# Altium schematic sheet MCU.SchDoc
size A4; SheetNumber: 4; SheetTotal: 4
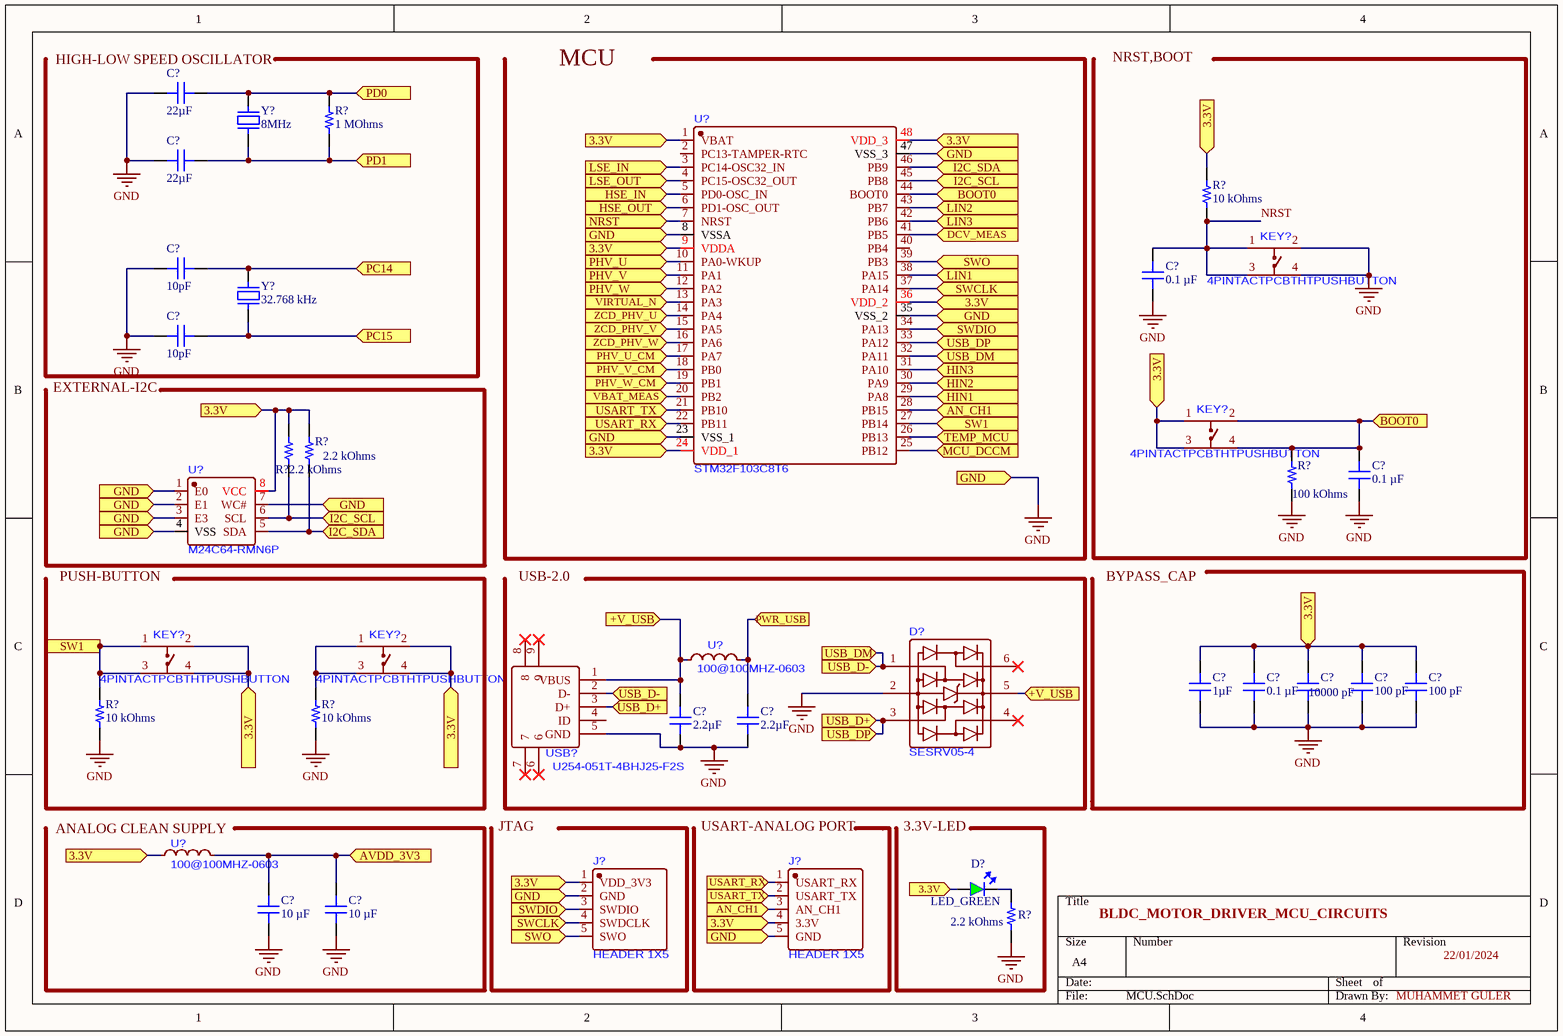
[diagram p0: MCU.SchDoc]

## Parts
(Parts that share a designator on the sheet are numbered #1, #2 ... from top to bottom, then left to right.)
C?#1  22µF  [CAP 1210_3225 - 2.8MM]
C?#2  22µF  [CAP 1210_3225 - 2.8MM]
C?#3  10pF  [CAP 1210_3225 - 1.4MM]
C?#4  0.1 µF  [CAP 1210_3225 - 1MM]
C?#5  10pF  [CAP 1210_3225 - 1.4MM]
C?#6  0.1 µF  [CAP 1210_3225 - 1MM]
C?#7  1µF  [CAP 1210_3225 - 2.8MM]
C?#8  0.1 µF  [CAP 1210_3225 - 1MM]
C?#9  10000 pF  [CAP 1210_3225 - 1MM]
C?#10  100 pF  [CAP 1210_3225 - 1MM]
C?#11  100 pF  [CAP 1210_3225 - 1MM]
C?#12  2.2µF  [CAP 1210_3225 - 2.8MM]
C?#13  2.2µF  [CAP 1210_3225 - 2.8MM]
C?#14  10 µF  [CAP 1210_3225 - 1MM]
C?#15  10 µF  [CAP 1210_3225 - 1MM]
D?#1  SESRV05-4  [SOT-23-6_L2.9-W1.6-P0.95-LS2.8-BR]
D?#2  LED_GREEN  [LED_GREEN]
J?#1  HEADER 1X5  [1X5-PIN-HEADER-2.54MM_ES]
J?#2  HEADER 1X5  [1X5-PIN-HEADER-2.54MM_ES]
KEY?#1  4PINTACTPCBTHTPUSHBUTTON  [SW-SMD_4P-L6.0-W6.0-P4.50-LS10.0_TL3301EF160QG]
KEY?#2  4PINTACTPCBTHTPUSHBUTTON  [SW-SMD_4P-L6.0-W6.0-P4.50-LS10.0_TL3301EF160QG]
KEY?#3  4PINTACTPCBTHTPUSHBUTTON  [SW-SMD_4P-L6.0-W6.0-P4.50-LS10.0_TL3301EF160QG]
KEY?#4  4PINTACTPCBTHTPUSHBUTTON  [SW-SMD_4P-L6.0-W6.0-P4.50-LS10.0_TL3301EF160QG]
R?#1  1 MOhms  [RES 1210_3225]
R?#2  10 kOhms  [RES 1210_3225]
R?#3  2.2 kOhms  [RES 1210_3225]
R?#4  2.2 kOhms  [RES 1210_3225]
R?#5  100 kOhms  [RES 1210_3225]
R?#6  10 kOhms  [RES 1210_3225]
R?#7  10 kOhms  [RES 1210_3225]
R?#8  2.2 kOhms  [RES 1210_3225]
U?#1  STM32F103C8T6  [UFQFPN-48_STM32]
U?#2  M24C64-RMN6P  [SOIC-8_L4.9-W3.8-P1.27-LS6.0-BL]
U?#3  100@100MHZ-0603  [L0603]
U?#4  100@100MHZ-0603  [L0603]
USB?  U254-051T-4BHJ25-F2S  [MICRO-USB-SMD_U254-051T-4BHJ25-F2S]
Y?#1  8MHz  [ABRACON ABLS]
Y?#2  32.768 kHz  [MICRO CRYSTAL CM8V H0.6mm]

## Ports
3.3V (in, see DRIVER[3A], DRIVER[4B], MCU[1B], MCU[1C], MCU[1D], MCU[2A], MCU[2B], MCU[2C], MCU[2D], MCU[3A], MCU[3B], MCU[3D], MCU[4A], MCU[4C], POWER[2A], POWER[3A], POWER[3B], POWER[4A], PROTECTION[2D], PROTECTION[4A], PROTECTION[4B]), 3.3V (in, see DRIVER[3A], DRIVER[4B], MCU[1B], MCU[1C], MCU[1D], MCU[2A], MCU[2B], MCU[2C], MCU[2D], MCU[3A], MCU[3B], MCU[3D], MCU[4A], POWER[2A], POWER[3A], POWER[3B], POWER[4A], PROTECTION[2D], PROTECTION[4A], PROTECTION[4B]), 3.3V (in, see DRIVER[3A], DRIVER[4B], MCU[1B], MCU[1C], MCU[1D], MCU[2A], MCU[2B], MCU[2C], MCU[2D], MCU[3A], MCU[3B], MCU[3D], MCU[4C], POWER[2A], POWER[3A], POWER[3B], POWER[4A], PROTECTION[2D], PROTECTION[4A], PROTECTION[4B]), 3.3V (in, see DRIVER[3A], DRIVER[4B], MCU[1B], MCU[1C], MCU[1D], MCU[2A], MCU[2B], MCU[2C], MCU[2D], MCU[3A], MCU[3B], MCU[4A], MCU[4C], POWER[2A], POWER[3A], POWER[3B], POWER[4A], PROTECTION[2D], PROTECTION[4A], PROTECTION[4B]), 3.3V (in, see DRIVER[3A], DRIVER[4B], MCU[1B], MCU[1C], MCU[1D], MCU[2A], MCU[2B], MCU[2C], MCU[2D], MCU[3B], MCU[3D], MCU[4A], MCU[4C], POWER[2A], POWER[3A], POWER[3B], POWER[4A], PROTECTION[2D], PROTECTION[4A], PROTECTION[4B]), 3.3V (in, see DRIVER[3A], DRIVER[4B], MCU[1B], MCU[1C], MCU[1D], MCU[2A], MCU[2B], MCU[2D], MCU[3A], MCU[3B], MCU[3D], MCU[4A], MCU[4C], POWER[2A], POWER[3A], POWER[3B], POWER[4A], PROTECTION[2D], PROTECTION[4A], PROTECTION[4B]), 3.3V (in, see DRIVER[3A], DRIVER[4B], MCU[1B], MCU[1C], MCU[1D], MCU[2A], MCU[2C], MCU[2D], MCU[3A], MCU[3B], MCU[3D], MCU[4A], MCU[4C], POWER[2A], POWER[3A], POWER[3B], POWER[4A], PROTECTION[2D], PROTECTION[4A], PROTECTION[4B]), 3.3V (in, see DRIVER[3A], DRIVER[4B], MCU[1B], MCU[1C], MCU[2A], MCU[2B], MCU[2C], MCU[2D], MCU[3A], MCU[3B], MCU[3D], MCU[4A], MCU[4C], POWER[2A], POWER[3A], POWER[3B], POWER[4A], PROTECTION[2D], PROTECTION[4A], PROTECTION[4B]), 3.3V (in, see DRIVER[3A], DRIVER[4B], MCU[1B], MCU[1D], MCU[2A], MCU[2B], MCU[2C], MCU[2D], MCU[3A], MCU[3B], MCU[3D], MCU[4A], MCU[4C], POWER[2A], POWER[3A], POWER[3B], POWER[4A], PROTECTION[2D], PROTECTION[4A], PROTECTION[4B]), 3.3V (in, see DRIVER[3A], DRIVER[4B], MCU[1C], MCU[1D], MCU[2A], MCU[2B], MCU[2C], MCU[2D], MCU[3A], MCU[3B], MCU[3D], MCU[4A], MCU[4C], POWER[2A], POWER[3A], POWER[3B], POWER[4A], PROTECTION[2D], PROTECTION[4A], PROTECTION[4B]), +V_USB (in, see MCU[2C]), +V_USB (in, see MCU[3C]), AN_CH1 (in, see MCU[2D]), AN_CH1 (in, see MCU[3B]), AVDD_3V3 (in), BOOT0 (in, see MCU[3A]), BOOT0 (in, see MCU[4B]), DCV_MEAS (in, see POWER[4C]), GND (in, see MCU[1B], MCU[1C], MCU[2A], MCU[2B], MCU[2D], MCU[3A], MCU[3B]), GND (in, see MCU[1B], MCU[1C], MCU[2A], MCU[2B], MCU[2D], MCU[3B]), GND (in, see MCU[1B], MCU[1C], MCU[2A], MCU[2D], MCU[3A], MCU[3B]), GND (in, see MCU[1B], MCU[1C], MCU[2B], MCU[2D], MCU[3A], MCU[3B]), HIN1 (in, see DRIVER[1A]), HIN2 (in, see DRIVER[1C]), HIN3 (in, see DRIVER[4C]), HSE_IN (in), HSE_OUT (in), I2C_SCL (in, see MCU[1C]), I2C_SCL (in, see MCU[3A]), I2C_SDA (in, see MCU[1C]), I2C_SDA (in, see MCU[3A]), LIN1 (in, see DRIVER[1A]), LIN2 (in, see DRIVER[1C]), LIN3 (in, see DRIVER[4C]), LSE_IN (in), LSE_OUT (in), MCU_DCCM (in, see POWER[4D]), NRST (in), PC14 (in), PC15 (in), PD0 (in), PD1 (in), PHV_U (in, see DRIVER[2A], DRIVER[3B], PROTECTION[3A]), PHV_U_CM (in, see POWER[3A], PROTECTION[4A]), PHV_V (in, see DRIVER[3B], DRIVER[4A], PROTECTION[3A]), PHV_V_CM (in, see POWER[3B], PROTECTION[4A]), PHV_W (in, see DRIVER[3B], DRIVER[4B], PROTECTION[3A]), PHV_W_CM (in, see POWER[4A], PROTECTION[4A]), PWR_USB (in), SW1 (in, see MCU[1C]), SW1 (in, see MCU[3B]), SWCLK (in, see MCU[2D]), SWCLK (in, see MCU[3B]), SWDIO (in, see MCU[2D]), SWDIO (in, see MCU[3B]), SWO (in, see MCU[2D]), SWO (in, see MCU[3B]), TEMP_MCU (in, see PROTECTION[3B], PROTECTION[4C]), USART_RX (in, see MCU[2B]), USART_RX (in, see MCU[2D]), USART_TX (in, see MCU[2B]), USART_TX (in, see MCU[2D]), USB_D+ (in, see MCU[2C]), USB_D+ (in, see MCU[3C]), USB_D- (in, see MCU[2C]), USB_D- (in, see MCU[3C]), USB_DM (in, see MCU[3B]), USB_DM (in, see MCU[3C]), USB_DP (in, see MCU[3B]), USB_DP (in, see MCU[3C]), VBAT_MEAS (in, see POWER[4C]), VIRTUAL_N (in, see DRIVER[2A], DRIVER[2B], DRIVER[4A], DRIVER[4B], PROTECTION[3A]), ZCD_PHV_U (in, see DRIVER[3A], DRIVER[4A], DRIVER[4B]), ZCD_PHV_V (in), ZCD_PHV_W (in)

## Nets
GND: C?#1.1 C?#2.1 C?#3.1 C?#4.2 C?#5.1 C?#6.2 C?#7.2 C?#8.2 C?#9.2 C?#10.2 C?#11.2 C?#12.2 C?#13.2 C?#14.2 C?#15.2 D?#1.2 J?#1.2(GND) J?#2.5(GND) KEY?#1.2 KEY?#1.4 R?#5.2 R?#6.2 R?#7.2 R?#8.2 U?#1.8(VSSA) U?#1.23(VSS_1) U?#1.35(VSS_2) U?#1.47(VSS_3) U?#2.1(E0) U?#2.2(E1) U?#2.3(E3) U?#2.4(VSS) U?#2.7(WC#) USB?.5(GND) ; port GND
3.3V: C?#7.1 C?#8.1 C?#9.1 C?#10.1 C?#11.1 D?#2.1(IN) J?#1.1(VDD_3V3) J?#2.4(3.3V) KEY?#2.1 KEY?#2.3 KEY?#3.2 KEY?#3.4 KEY?#4.2 KEY?#4.4 R?#2.1 R?#3.1 R?#4.1 U?#1.1(VBAT) U?#1.9(VDDA) U?#1.24(VDD_1) U?#1.36(VDD_2) U?#1.48(VDD_3) U?#2.8(VCC) U?#4.1 ; port 3.3V
+V_USB: C?#12.1 D?#1.5 U?#3.1 USB?.1(VBUS) ; port +V_USB
AN_CH1: J?#2.3(AN_CH1) U?#1.28(PB15) ; port AN_CH1
AVDD_3V3: C?#14.1 C?#15.1 U?#4.2 ; port AVDD_3V3
BOOT0: C?#6.1 KEY?#2.2 KEY?#2.4 R?#5.1 U?#1.44(BOOT0) ; port BOOT0
DCV_MEAS: U?#1.41(PB5) ; port DCV_MEAS
HIN1: U?#1.29(PA8) ; port HIN1
HIN2: U?#1.30(PA9) ; port HIN2
HIN3: U?#1.31(PA10) ; port HIN3
HSE_IN: U?#1.5(PD0-OSC_IN) ; port HSE_IN
HSE_OUT: U?#1.6(PD1-OSC_OUT) ; port HSE_OUT
I2C_SCL: R?#3.2 U?#1.45(PB8) U?#2.6(SCL) ; port I2C_SCL
I2C_SDA: R?#4.2 U?#1.46(PB9) U?#2.5(SDA) ; port I2C_SDA
LIN1: U?#1.38(PA15) ; port LIN1
LIN2: U?#1.43(PB7) ; port LIN2
LIN3: U?#1.42(PB6) ; port LIN3
LSE_IN: U?#1.3(PC14-OSC32_IN) ; port LSE_IN
LSE_OUT: U?#1.4(PC15-OSC32_OUT) ; port LSE_OUT
MCU_DCCM: U?#1.25(PB12) ; port MCU_DCCM
NRST: U?#1.7(NRST) ; port NRST
NRST: C?#4.1 KEY?#1.1 KEY?#1.3 R?#2.2  [a separate net that carries the same name]
PC14: C?#3.2 Y?#2.1 ; port PC14
PC15: C?#5.2 Y?#2.2 ; port PC15
PD0: C?#1.2 R?#1.1 Y?#1.1 ; port PD0
PD1: C?#2.2 R?#1.2 Y?#1.2 ; port PD1
PHV_U: U?#1.10(PA0-WKUP) ; port PHV_U
PHV_U_CM: U?#1.17(PA7) ; port PHV_U_CM
PHV_V: U?#1.11(PA1) ; port PHV_V
PHV_V_CM: U?#1.18(PB0) ; port PHV_V_CM
PHV_W: U?#1.12(PA2) ; port PHV_W
PHV_W_CM: U?#1.19(PB1) ; port PHV_W_CM
PWR_USB: C?#13.1 U?#3.2 ; port PWR_USB
SW1: KEY?#3.1 KEY?#3.3 R?#6.1 U?#1.27(PB14) ; port SW1
SWCLK: J?#1.4(SWDCLK) U?#1.37(PA14) ; port SWCLK
SWDIO: J?#1.3(SWDIO) U?#1.34(PA13) ; port SWDIO
SWO: J?#1.5(SWO) U?#1.39(PB3) ; port SWO
TEMP_MCU: U?#1.26(PB13) ; port TEMP_MCU
USART_RX: J?#2.1(USART_RX) U?#1.22(PB11) ; port USART_RX
USART_TX: J?#2.2(USART_TX) U?#1.21(PB10) ; port USART_TX
USB_D+: D?#1.3 U?#1.33(PA12) USB?.3(D+) ; port USB_DP, port USB_D+
USB_D-: D?#1.1 U?#1.32(PA11) USB?.2(D-) ; port USB_DM, port USB_D-
VBAT_MEAS: U?#1.20(PB2) ; port VBAT_MEAS
VIRTUAL_N: U?#1.13(PA3) ; port VIRTUAL_N
ZCD_PHV_U: U?#1.14(PA4) ; port ZCD_PHV_U
ZCD_PHV_V: U?#1.15(PA5) ; port ZCD_PHV_V
ZCD_PHV_W: U?#1.16(PA6) ; port ZCD_PHV_W
NetD?#2_2: D?#2.2(OUT) R?#8.1
NetKEY?#4_1: KEY?#4.1 KEY?#4.3 R?#7.1

Not connected (* = marked no-connect by the designer): D?#1 4* 6*; U?#1 2(PC13-TAMPER-RTC) 40(PB4); USB? 4(ID) 6* 7* 8* 9*

## Notes on the sheet
- HIGH-LOW SPEED OSCILLATOR
- MCU
- NRST,BOOT
- (near C?#5) EXTERNAL-I2C
- PUSH-BUTTON
- USB-2.0
- BYPASS_CAP
- (near U?#4) ANALOG CLEAN SUPPLY
- JTAG
- (near J?#2) USART-ANALOG PORT
- 3.3V-LED
- BLDC_MOTOR_DRIVER_MCU_CIRCUITS
- 22/01/2024
- MUHAMMET GÜLER

## Library data of the parts
C?#1 C?#2 = 1210ZC226MAT2A: CAP CER 22UF 10V X7R 1210; manufacturer: AVX Corporation; Tolerance: ±20%; Part Number: 1210ZC226MAT2A; Value: 22µF; Applications: General Purpose; Capacitance: 22µF; componentlink1description: Datasheet; componentlink1url: http://datasheets.avx.com/X7RDielectric.pdf; componentlink2description: DigiKey Link; componentlink2url: http://digikey.com/product-detail/en/avx-corporation/1210ZC226MAT2A/478-7982-1-ND/3881605; Device Package: 1210 (3225 Metric); lastupdated: 2.09.2020 01:10:53; Lifecycle Status: Active; Minimum Order: 1; Mounting Type: Surface Mount, MLCC; Operating Temperature: -55°C ~ 125°C; Package / Case: 1210 (3225 Metric); packaging: TapeAndReel; partid: 23621; Part Status: Active; price: 0.60; series: -; Size / Dimension: 0.126" L x 0.098" W (3.20mm x 2.50mm); Supplier 1: DigiKey; Supplier Part Number 1: 478-7982-1-ND; Temperature Coefficient: X7R; Thickness (Max): 0.110" (2.79mm); Voltage - Rated: 10V
C?#3 C?#5 = 12102U100JAT2A: CAP CER 10PF 200V NP0 1210; manufacturer: AVX Corporation; Temperature Coefficient: C0G, NP0; Tolerance: ±5%; Part Number: 12102U100JAT2A; Value: 10pF; Applications: RF, Microwave, High Frequency; Capacitance: 10pF; componentlink1description: Datasheet; componentlink1url: http://datasheets.avx.com/U-Series.pdf; componentlink2description: DigiKey Link; componentlink2url: http://digikey.com/product-detail/en/avx-corporation/12102U100JAT2A/478-10909-1-ND/7536424; Device Package: 1210 (3225 Metric); Features: Ultra Low ESR; lastupdated: 2.09.2020 01:10:31; Lifecycle Status: Active; Minimum Order: 1; Mounting Type: Surface Mount, MLCC; Operating Temperature: -55°C ~ 125°C; Package / Case: 1210 (3225 Metric); packaging: TapeAndReel; partid: 25047; Part Status: Active; price: 0.17; series: U; Size / Dimension: 0.126" L x 0.098" W (3.20mm x 2.49mm); Supplier 1: DigiKey; Supplier Part Number 1: 478-10909-1-ND; Thickness (Max): 0.055" (1.40mm); Voltage - Rated: 200V
C?#4 C?#6 C?#8 = 1210Y0500104KST: 1210 50VDC 100NF 10% X7R(2R1) AE; manufacturer: Knowles Syfer; Voltage - Rated: 50V; Part Number: 1210Y0500104KST; Value: 0.1 µF; Applications: Automotive, Boardflex Sensitive; Capacitance: 0.1 µF; componentlink2description: DigiKey Link; componentlink2url: https://www.digikey.com/en/products/detail/knowles-syfer/1210Y0500104KST/18879780; Device Package: 1210 (3225 Metric); Features: Soft Termination; lastupdated: 17.01.2024 20:42:33; Lifecycle Status: Active; Minimum Order: 1; Mounting Type: Surface Mount, MLCC; Operating Temperature: -55°C ~ 125°C; Package / Case: 1210 (3225 Metric); packaging: TapeAndReel; partid: 53037; Part Status: Active; price: 0.16; Ratings: AEC-Q200; series: FlexiCap™; Size / Dimension: 0.126" L x 0.098" W (3.20mm x 2.50mm); Supplier 1: DigiKey; Supplier Part Number 1: 1608-1210Y0500104KSTCT-ND; Temperature Coefficient: X7R (2R1); Thickness (Max): 0.079" (2.00mm); Tolerance: ±10%
C?#7 = 12101C105MAT2A: CAP CER 1UF 100V X7R 1210; manufacturer: AVX Corporation; Tolerance: ±20%; Part Number: 12101C105MAT2A; Value: 1µF; Applications: General Purpose; Capacitance: 1µF; componentlink1description: Datasheet; componentlink1url: http://datasheets.avx.com/X7RDielectric.pdf; componentlink2description: DigiKey Link; componentlink2url: http://digikey.com/product-detail/en/avx-corporation/12101C105MAT2A/478-2571-1-ND/717516; Device Package: 1210 (3225 Metric); lastupdated: 2.09.2020 01:10:52; Lifecycle Status: Active; Minimum Order: 1; Mounting Type: Surface Mount, MLCC; Operating Temperature: -55°C ~ 125°C; Package / Case: 1210 (3225 Metric); packaging: TapeAndReel; partid: 23736; Part Status: Active; price: 0.21; series: -; Size / Dimension: 0.126" L x 0.098" W (3.20mm x 2.50mm); Supplier 1: DigiKey; Supplier Part Number 1: 478-2571-1-ND; Temperature Coefficient: X7R; Thickness (Max): 0.110" (2.79mm); Voltage - Rated: 100V
C?#9 = C1210X103JDGACAUTO: CAP CER 1210 10NF 1000V C0G 5%; manufacturer: KEMET; Temperature Coefficient: C0G, NP0; Voltage - Rated: 1000V (1kV); Part Number: C1210X103JDGACAUTO; Value: 10000 pF; Applications: Automotive, Boardflex Sensitive; Capacitance: 10000 pF; componentlink1description: Datasheet; componentlink1url: https://api.kemet.com/component-edge/download/datasheet/C1210X103JDGACAUTO.pdf; componentlink2description: DigiKey Link; componentlink2url: https://www.digikey.com/en/products/detail/kemet/C1210X103JDGACAUTO/10131738; Device Package: 1210 (3225 Metric); Features: Low ESL, Soft Termination, High Voltage; lastupdated: 17.01.2024 20:42:53; Lifecycle Status: Active; Minimum Order: 1; Mounting Type: Surface Mount, MLCC; Operating Temperature: -55°C ~ 125°C; Package / Case: 1210 (3225 Metric); packaging: TapeAndReel; partid: 24146; Part Status: Active; price: 0.96; Ratings: AEC-Q200; series: SMD Auto C0G HV Flex; Size / Dimension: 0.130" L x 0.102" W (3.30mm x 2.60mm); Supplier 1: DigiKey; Supplier Part Number 1: 399-20934-1-ND; Thickness (Max): 0.110" (2.80mm); Tolerance: ±5%
C?#10 C?#11 = VJ1210A101JXGAT5Z: CAP CER 100PF 1KV C0G/NP0 1210; manufacturer: Vishay Vitramon; Temperature Coefficient: C0G, NP0; Tolerance: ±5%; Voltage - Rated: 1000V (1kV); Part Number: VJ1210A101JXGAT5Z; Value: 100 pF; Applications: General Purpose; Capacitance: 100 pF; componentlink1description: Datasheet; componentlink1url: http://www.vishay.com/docs/45197/vjhvarcguard.pdf; componentlink2description: DigiKey Link; componentlink2url: https://www.digikey.com/en/products/detail/vishay-vitramon/VJ1210A101JXGAT5Z/1559962; Device Package: 1210 (3225 Metric); Features: High Voltage; lastupdated: 17.01.2024 20:43:04; Lifecycle Status: Active; Minimum Order: 1; Mounting Type: Surface Mount, MLCC; Operating Temperature: -55°C ~ 125°C; Package / Case: 1210 (3225 Metric); packaging: TapeAndReel; partid: 24731; Part Status: Active; price: 0.44; series: VJ HVArc Guard™; Size / Dimension: 0.126" L x 0.098" W (3.20mm x 2.50mm); Supplier 1: DigiKey; Supplier Part Number 1: 720-1035-1-ND; Thickness (Max): 0.067" (1.70mm)
C?#12 C?#13 = 12105C225KAZ2A: CAP CER 2.2UF 50V X7R 1210; manufacturer: AVX Corporation; Tolerance: ±10%; Part Number: 12105C225KAZ2A; Value: 2.2µF; Applications: Boardflex Sensitive; Capacitance: 2.2µF; componentlink1description: Datasheet; componentlink1url: http://datasheets.avx.com/FlexitermMLCC.pdf; componentlink2description: DigiKey Link; componentlink2url: http://digikey.com/product-detail/en/avx-corporation/12105C225KAZ2A/478-3591-1-ND/1024944; Device Package: 1210 (3225 Metric); Features: Soft Termination; lastupdated: 2.09.2020 01:10:53; Lifecycle Status: Active; Minimum Order: 1; Mounting Type: Surface Mount, MLCC; Operating Temperature: -55°C ~ 125°C; Package / Case: 1210 (3225 Metric); packaging: TapeAndReel; partid: 23620; Part Status: Active; price: 0.53; series: FLEXITERM®; Size / Dimension: 0.126" L x 0.098" W (3.20mm x 2.50mm); Supplier 1: DigiKey; Supplier Part Number 1: 478-3591-1-ND; Temperature Coefficient: X7R; Thickness (Max): 0.110" (2.79mm); Voltage - Rated: 50V
C?#14 C?#15 = GCG32ER71E106KA12L: CAP CER 10UF 25V X7R 1210; manufacturer: Murata Electronics; Tolerance: ±10%; Part Number: GCG32ER71E106KA12L; Value: 10 µF; Applications: Automotive; Capacitance: 10 µF; componentlink1description: Datasheet; componentlink1url: https://search.murata.co.jp/Ceramy/image/img/A01X/G101/ENG/GCG32ER71E106KA12-01.pdf; componentlink2description: DigiKey Link; componentlink2url: https://www.digikey.com/en/products/detail/murata-electronics/GCG32ER71E106KA12L/9867908; Device Package: 1210 (3225 Metric); Features: Epoxy Mountable; lastupdated: 18.01.2024 20:41:44; Lifecycle Status: Active; Minimum Order: 1; Mounting Type: Surface Mount, MLCC, Epoxy; Operating Temperature: -55°C ~ 125°C; Package / Case: 1210 (3225 Metric); packaging: TapeAndReel; partid: 23619; Part Status: Active; price: 0.30; Ratings: AEC-Q200; series: GCG; Size / Dimension: 0.126" L x 0.098" W (3.20mm x 2.50mm); Supplier 1: DigiKey; Supplier Part Number 1: 490-18199-1-ND; Temperature Coefficient: X7R; Thickness (Max): 0.110" (2.80mm); Voltage - Rated: 25V
J?#1 J?#2 = HEADER 1X5 COPY
R?#1 = TNPV12101M00DEEA: RES SMD 1M OHM 0.5% 1/3W 1210; Manufacturer: Vishay Dale; Power (Watts): 0.333W, 1/3W; Temperature Coefficient: ±25ppm/°C; Part Number: TNPV12101M00DEEA; ComponentLink1Description: Datasheet; ComponentLink1URL: http://www.vishay.com/docs/28881/tnpve3.pdf; ComponentLink2Description: DigiKey Link; ComponentLink2URL: https://www.digikey.com/en/products/detail/vishay-dale/TNPV12101M00DEEA/6570120; Composition: Thin Film; Device Package: 1210 (3225 Metric); Features: Anti-Sulfur, Automotive AEC-Q200, High Voltage, Moisture Resistant; Height - Seated (Max): 0.030" (0.75mm); LastUpdated: 17.01.2024 21:50:34; Lifecycle Status: Active; Minimum Order: 1; Number of Terminations: 2; Operating Temperature: -55°C ~ 125°C; Package / Case: 1210 (3225 Metric); Packaging: TapeAndReel; Part Status: Active; Price: 0.46; Ratings: AEC-Q200; Resistance: 1 MOhms; Series: TNPV; Size / Dimension: 0.126" L x 0.096" W (3.20mm x 2.45mm); Supplier 1: DigiKey; Supplier Part Number 1: 541-3267-1-ND; Supplier Device Package: 1210; Tolerance: ±0.5%; Value: 1 MOhms
R?#2 R?#6 R?#7 = RMCF1210FT10K0: RES 10K OHM 1% 1/2W 1210; Manufacturer: Stackpole Electronics Inc; Power (Watts): 0.5W, 1/2W; Temperature Coefficient: ±100ppm/°C; Part Number: RMCF1210FT10K0; ComponentLink1Description: Datasheet; ComponentLink1URL: https://www.seielect.com/catalog/sei-rmcf_rmcp.pdf; ComponentLink2Description: DigiKey Link; ComponentLink2URL: https://www.digikey.com/en/products/detail/stackpole-electronics-inc/RMCF1210FT10K0/1758528; Composition: Thick Film; Device Package: 1210 (3225 Metric); Features: Automotive AEC-Q200; Height - Seated (Max): 0.028" (0.70mm); Lifecycle Status: Active; Minimum Order: 1; Number of Terminations: 2; Operating Temperature: -55°C ~ 155°C; Package / Case: 1210 (3225 Metric); Packaging: TapeAndReel; Part Status: Active; Price: 0.01; Ratings: AEC-Q200; Resistance: 10 kOhms; Series: RMCF; Size / Dimension: 0.126" L x 0.098" W (3.20mm x 2.50mm); Supplier 1: DigiKey; Supplier Part Number 1: RMCF1210FT10K0CT-ND; Supplier Device Package: 1210; Tolerance: ±1%; Value: 10 kOhms
  R?#2: LastUpdated: 17.01.2024 21:50:41
  R?#6 R?#7: LastUpdated: 16.01.2024 21:51:52
R?#3 R?#4 = RK73B2ETTD222J: RES 2.2K OHM 5% 1/2W 1210; Manufacturer: KOA Speer Electronics, Inc.; Power (Watts): 0.5W, 1/2W; Temperature Coefficient: ±200ppm/°C; Part Number: RK73B2ETTD222J; ComponentLink1Description: Datasheet; ComponentLink1URL: http://www.koaspeer.com/catimages/Products/RK73B/RK73B.pdf; ComponentLink2Description: DigiKey Link; ComponentLink2URL: https://www.digikey.com/en/products/detail/koa-speer-electronics-inc/RK73B2ETTD222J/10314985; Composition: Thick Film; Device Package: 1210 (3225 Metric); Features: Automotive AEC-Q200; Height - Seated (Max): 0.028" (0.70mm); LastUpdated: 18.01.2024 21:50:16; Lifecycle Status: Active; Minimum Order: 1; Number of Terminations: 2; Operating Temperature: -55°C ~ 155°C; Package / Case: 1210 (3225 Metric); Packaging: TapeAndReel; Part Status: Active; Price: 0.01; Ratings: AEC-Q200; Resistance: 2.2 kOhms; Series: RK73B; Size / Dimension: 0.126" L x 0.102" W (3.20mm x 2.60mm); Supplier 1: DigiKey; Supplier Part Number 1: 2019-RK73B2ETTD222JCT-ND; Supplier Device Package: 1210; Tolerance: ±5%; Value: 2.2 kOhms
R?#5 = RMCF1210FT100K: RES 100K OHM 1% 1/2W 1210; Manufacturer: Stackpole Electronics Inc; Power (Watts): 0.5W, 1/2W; Temperature Coefficient: ±100ppm/°C; Part Number: RMCF1210FT100K; ComponentLink1Description: Datasheet; ComponentLink1URL: https://www.seielect.com/catalog/sei-packaging.pdf; ComponentLink2Description: DigiKey Link; ComponentLink2URL: https://www.digikey.com/en/products/detail/stackpole-electronics-inc/RMCF1210FT100K/1758471; Composition: Thick Film; Device Package: 1210 (3225 Metric); Features: Automotive AEC-Q200; Height - Seated (Max): 0.028" (0.70mm); LastUpdated: 17.01.2024 21:50:32; Lifecycle Status: Active; Minimum Order: 1; Number of Terminations: 2; Operating Temperature: -55°C ~ 155°C; Package / Case: 1210 (3225 Metric); Packaging: TapeAndReel; Part Status: Active; Price: 0.01; Ratings: AEC-Q200; Resistance: 100 kOhms; Series: RMCF; Size / Dimension: 0.126" L x 0.098" W (3.20mm x 2.50mm); Supplier 1: DigiKey; Supplier Part Number 1: RMCF1210FT100KCT-ND; Supplier Device Package: 1210; Tolerance: ±1%; Value: 100 kOhms
R?#8 = SG732ETTD222K: RES 2.2K OHM 10% 1/2W 1210; Manufacturer: KOA Speer Electronics, Inc.; Power (Watts): 0.5W, 1/2W; Temperature Coefficient: ±200ppm/°C; Part Number: SG732ETTD222K; ComponentLink1Description: Datasheet; ComponentLink1URL: https://www.koaspeer.com/pdfs/SG73.pdf; ComponentLink2Description: DigiKey Link; ComponentLink2URL: https://www.digikey.com/en/products/detail/koa-speer-electronics-inc/SG732ETTD222K/10196464; Composition: Thick Film; Device Package: 1210 (3225 Metric); Features: Automotive AEC-Q200, Moisture Resistant, Pulse Withstanding; Height - Seated (Max): 0.028" (0.70mm); LastUpdated: 20.01.2024 21:48:13; Lifecycle Status: Active; Minimum Order: 1; Number of Terminations: 2; Operating Temperature: -55°C ~ 155°C; Package / Case: 1210 (3225 Metric); Packaging: TapeAndReel; Part Status: Active; Price: 0.04; Ratings: AEC-Q200; Resistance: 2.2 kOhms; Series: SG73; Size / Dimension: 0.126" L x 0.102" W (3.20mm x 2.60mm); Supplier 1: DigiKey; Supplier Part Number 1: 2019-SG732ETTD222KCT-ND; Supplier Device Package: 1210; Tolerance: ±10%; Value: 2.2 kOhms
Y?#1 = ABLS-8.000MHZ-B4H-T: CRYSTAL 8.0000MHZ 18PF SMD; Manufacturer: Abracon LLC; ESR (Equivalent Series Resistance): 80 Ohms; Frequency Stability: ±35ppm; Frequency Tolerance: ±30ppm; Operating Mode: Fundamental; Part Number: ABLS-8.000MHZ-B4H-T; ComponentLink1Description: Datasheet; ComponentLink1URL: https://abracon.com/Resonators/abls.pdf; ComponentLink2Description: DigiKey Link; ComponentLink2URL: http://digikey.com/product-detail/en/abracon-llc/ABLS-8.000MHZ-B4H-T/535-15002-1-ND/9998079; Frequency: 8MHz; Height - Seated (Max): 0.165" (4.20mm); LastUpdated: 17.01.2024 21:35:12; Lifecycle Status: Active; Load Capacitance: 18pF; Minimum Order: 0; Mounting Type: Surface Mount; Operating Temperature: -20°C ~ 70°C; Package / Case: HC-49/US; Packaging: TapeAndReel; PartId: 115; Part Status: Active; Price: 0.18; Series: ABLS; Size / Dimension: 0.449" L x 0.185" W (11.40mm x 4.70mm); Supplier 1: DigiKey; Supplier Part Number 1: 535-15002-1-ND; Type: MHz Crystal; Value: 8MHz
Y?#2 = CM8V-T1A-32.768KHZ-12.5PF-20PPM-TA-QA: CRYSTAL 32.7680KHZ 12.5PF SMD; Manufacturer: Micro Crystal AG; ESR (Equivalent Series Resistance): 70 kOhms; Frequency Tolerance: ±20ppm; Operating Mode: Fundamental; Part Number: CM8V-T1A-32.768KHZ-12.5PF-20PPM-TA-QA; ComponentLink1Description: Datasheet; ComponentLink1URL: https://www.microcrystal.com/fileadmin/Media/Products/32kHz/Datasheet/CM8V-T1A.pdf; ComponentLink2Description: DigiKey Link; ComponentLink2URL: https://www.digikey.com/en/products/detail/micro-crystal-ag/CM8V-T1A-32-768KHZ-12-5PF-20PPM-TA-QA/10499086; Frequency: 32.768 kHz; Height - Seated (Max): 0.024" (0.60mm); LastUpdated: 17.01.2024 21:57:28; Lifecycle Status: Active; Load Capacitance: 12.5pF; Minimum Order: 1; Mounting Type: Surface Mount; Operating Temperature: -40°C ~ 85°C; Package / Case: 2-SMD, No Lead; Packaging: TapeAndReel; PartId: 834; Part Status: Active; Price: 0.30; Ratings: AEC-Q200; Series: CM8V; Size / Dimension: 0.079" L x 0.047" W (2.00mm x 1.20mm); Supplier 1: DigiKey; Supplier Part Number 1: 2195-CM8V-T1A-32.768KHZ-12.5PF-20PPM-TA-QACT-ND; Type: kHz Crystal (Tuning Fork); Value: 32.768 kHz